# Altium schematic sheet [02] - BLOCK DIAGRAM.SchDoc: Block Diagram
size A3; DrawnBy: Le Viet Trong; SheetNumber: 2; SheetTotal: 6
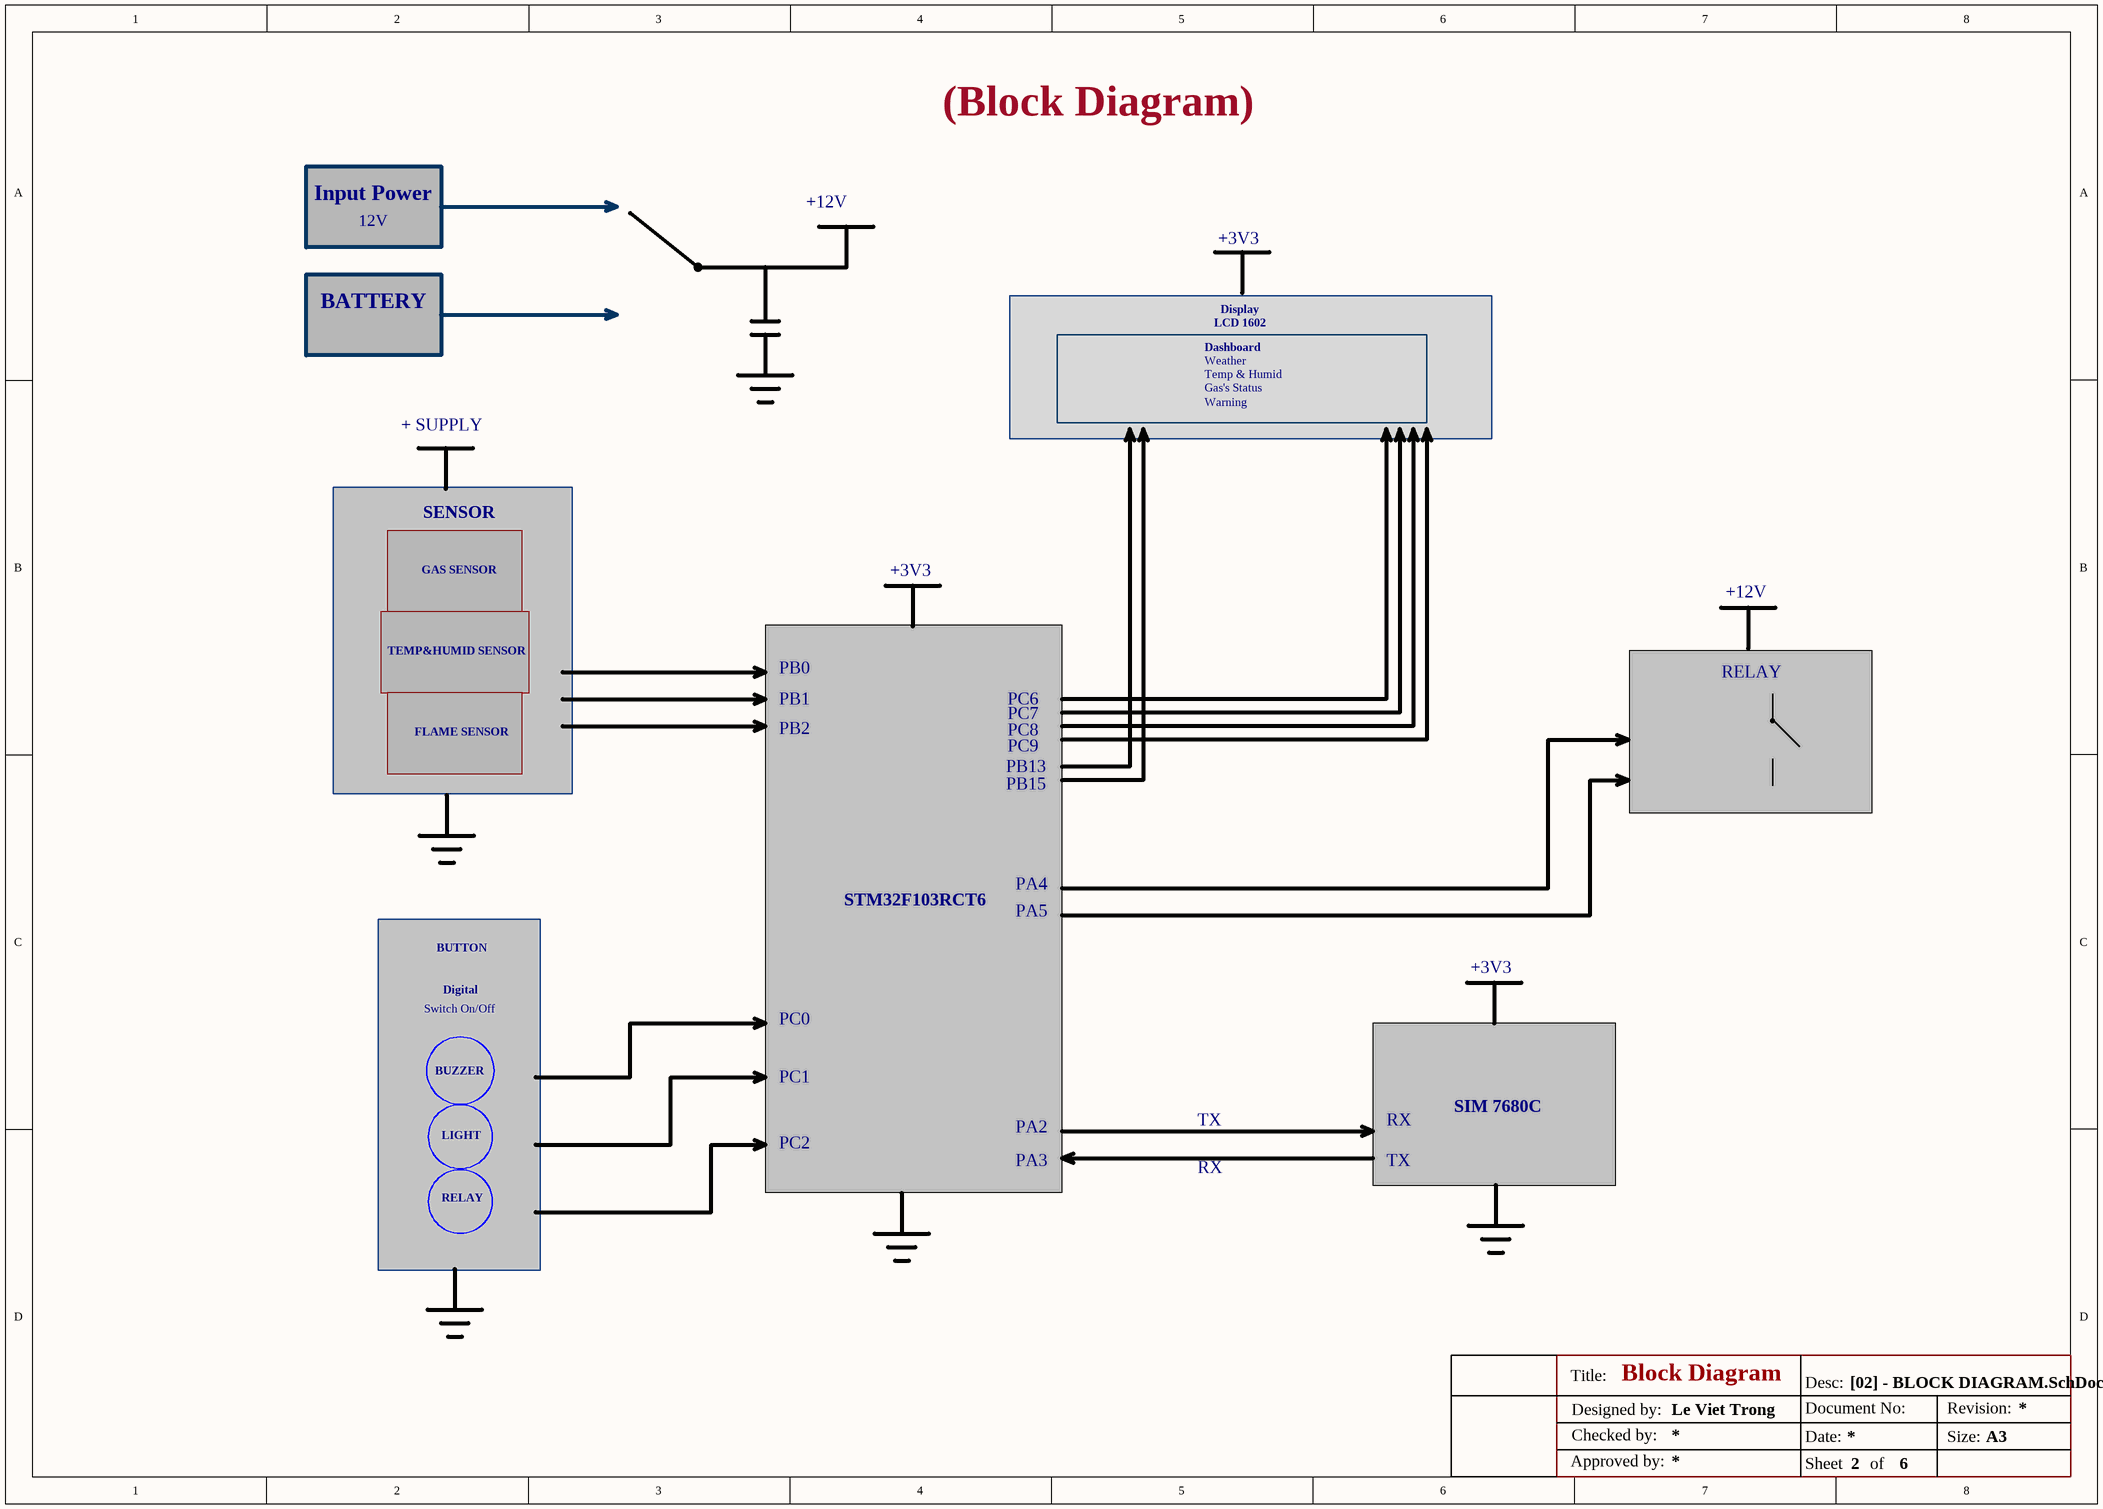
[diagram p0: [02] - BLOCK DIAGRAM.SchDoc]

## Notes on the sheet
- (Block Diagram)
- Input Power
- 12V
- +12V
- +3V3
- BATTERY
- Display
- Dashboard
- Weather
- Temp & Humid
- LCD 1602
- + SUPPLY
- Gas's Status
- Warning
- SENSOR
- GAS SENSOR
- TEMP&HUMID SENSOR
- PB0
- PB1
- PC6
- PC7
- RELAY
- FLAME SENSOR
- PB2
- PB13
- PC8
- PC9
- PB15
- STM32F103RCT6
- PA4
- PA5
- BUTTON
- Digital
- Switch On/Off
- PC0
- BUZZER
- PC1
- TX
- RX
- SIM 7680C
- LIGHT
- PC2
- PA2
- PA3
- Title:
- Desc:
- Designed by:
- Checked by:
- Date:
- Document No:
- Revision:
- Size:
- A3
- Approved by:
- Sheet
- of